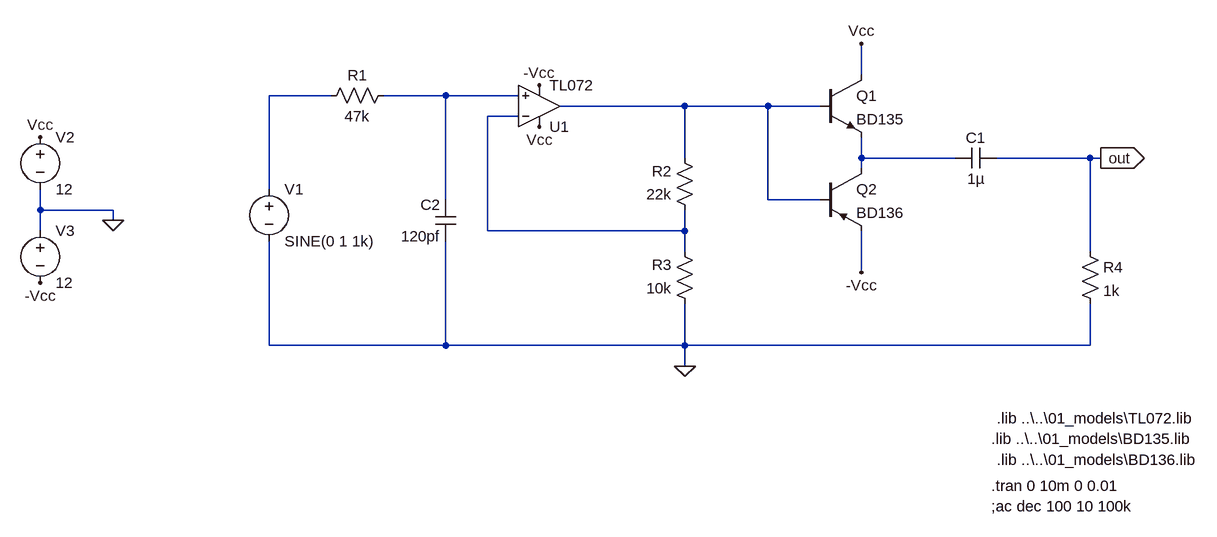
[diagram p0: schematic classb.asc]
classb.asc, the LTspice schematic file:
Version 4
SHEET 1 1248 744
WIRE 672 64 672 16
WIRE -144 96 -240 96
WIRE 32 96 -64 96
WIRE 144 96 32 96
WIRE 400 112 208 112
WIRE 528 112 400 112
WIRE 608 112 528 112
WIRE 144 128 96 128
WIRE 400 192 400 112
WIRE 672 192 672 160
WIRE 816 192 672 192
WIRE 1024 192 880 192
WIRE 1040 192 1024 192
WIRE 672 208 672 192
WIRE -240 240 -240 96
WIRE 32 256 32 96
WIRE 528 256 528 112
WIRE 608 256 528 256
WIRE -592 272 -592 240
WIRE -480 272 -592 272
WIRE -480 288 -480 272
WIRE -592 304 -592 272
WIRE 96 304 96 128
WIRE 400 304 400 272
WIRE 400 304 96 304
WIRE 400 336 400 304
WIRE 1024 336 1024 192
WIRE 672 368 672 304
WIRE -240 480 -240 320
WIRE 32 480 32 320
WIRE 32 480 -240 480
WIRE 400 480 400 416
WIRE 400 480 32 480
WIRE 1024 480 1024 416
WIRE 1024 480 400 480
WIRE 400 512 400 480
FLAG 400 512 0
FLAG -480 288 0
FLAG -592 160 Vcc
FLAG -592 384 -Vcc
FLAG 176 80 -Vcc
FLAG 672 16 Vcc
FLAG 176 144 Vcc
FLAG 672 368 -Vcc
FLAG 1040 192 out
IOPIN 1040 192 Out
SYMBOL Opamps\\opamp2 176 176 M180
SYMATTR InstName U1
SYMATTR Value TL072
SYMBOL res -48 80 R90
WINDOW 0 0 56 VBottom 2
WINDOW 3 32 56 VTop 2
SYMATTR InstName R1
SYMATTR Value 47k
SYMBOL res 416 288 R180
WINDOW 0 36 76 Left 2
WINDOW 3 36 40 Left 2
SYMATTR InstName R2
SYMATTR Value 22k
SYMBOL res 416 432 R180
WINDOW 0 36 76 Left 2
WINDOW 3 36 40 Left 2
SYMATTR InstName R3
SYMATTR Value 10k
SYMBOL npn 608 64 R0
SYMATTR InstName Q1
SYMATTR Value BD135
SYMBOL pnp 608 208 R0
SYMATTR InstName Q2
SYMATTR Value BD136
SYMBOL cap 880 176 R90
WINDOW 0 0 32 VBottom 2
WINDOW 3 32 32 VTop 2
SYMATTR InstName C1
SYMATTR Value 1µ
SYMBOL cap 48 320 R180
WINDOW 0 24 56 Left 2
WINDOW 3 24 8 Left 2
SYMATTR InstName C2
SYMATTR Value 120pf
SYMBOL voltage -240 224 R0
WINDOW 123 0 0 Left 2
WINDOW 39 0 0 Left 2
SYMATTR InstName V1
SYMATTR Value SINE(0 1 1k)
SYMBOL res 1008 320 R0
SYMATTR InstName R4
SYMATTR Value 1k
SYMBOL voltage -592 144 R0
WINDOW 123 0 0 Left 2
WINDOW 39 0 0 Left 2
SYMATTR InstName V2
SYMATTR Value 12
SYMBOL voltage -592 288 R0
WINDOW 123 0 0 Left 2
WINDOW 39 0 0 Left 2
SYMATTR InstName V3
SYMATTR Value 12
TEXT 880 592 Left 2 !.lib ..\\..\\01_models\\TL072.lib
TEXT 872 624 Left 2 !.lib ..\\..\\01_models\\BD135.lib
TEXT 880 656 Left 2 !.lib ..\\..\\01_models\\BD136.lib
TEXT 872 696 Left 2 !.tran 0 10m 0 0.01
TEXT 872 728 Left 2 !;ac dec 100 10 100k

The netlist it stands for:
* classb.asc
XU1 N002 N004 Vcc -Vcc N003 TL072  ; pins In+ In- V+ V- OUT
R1 N002 N001 47k
R2 N004 N003 22k
R3 0 N004 10k
Q1 Vcc N003 N005 0 BD135
Q2 N005 N003 -Vcc 0 BD136
C1 out N005 1µ
C2 0 N002 120pf
V1 N001 0 SINE(0 1 1k)
R4 out 0 1k
V2 Vcc 0 12
V3 0 -Vcc 12
.model NPN NPN
.model PNP PNP
.lib standard.bjt
.lib ..\..\01_models\TL072.lib
.lib ..\..\01_models\BD135.lib
.lib ..\..\01_models\BD136.lib
.tran 0 10m 0 0.01
;ac dec 100 10 100k
.backanno
.end